# Altium schematic sheet main_2.SchDoc: main
size 282 x 200 mm; Date: 9/25/2019 7:26:07 PM; SheetNumber: 3; CNAME: RJ Cunningham; GateName_1: G$1; SymbolName_1: A4L-LOC; LibraryName: frames; DeviceSetName: A4L-LOC
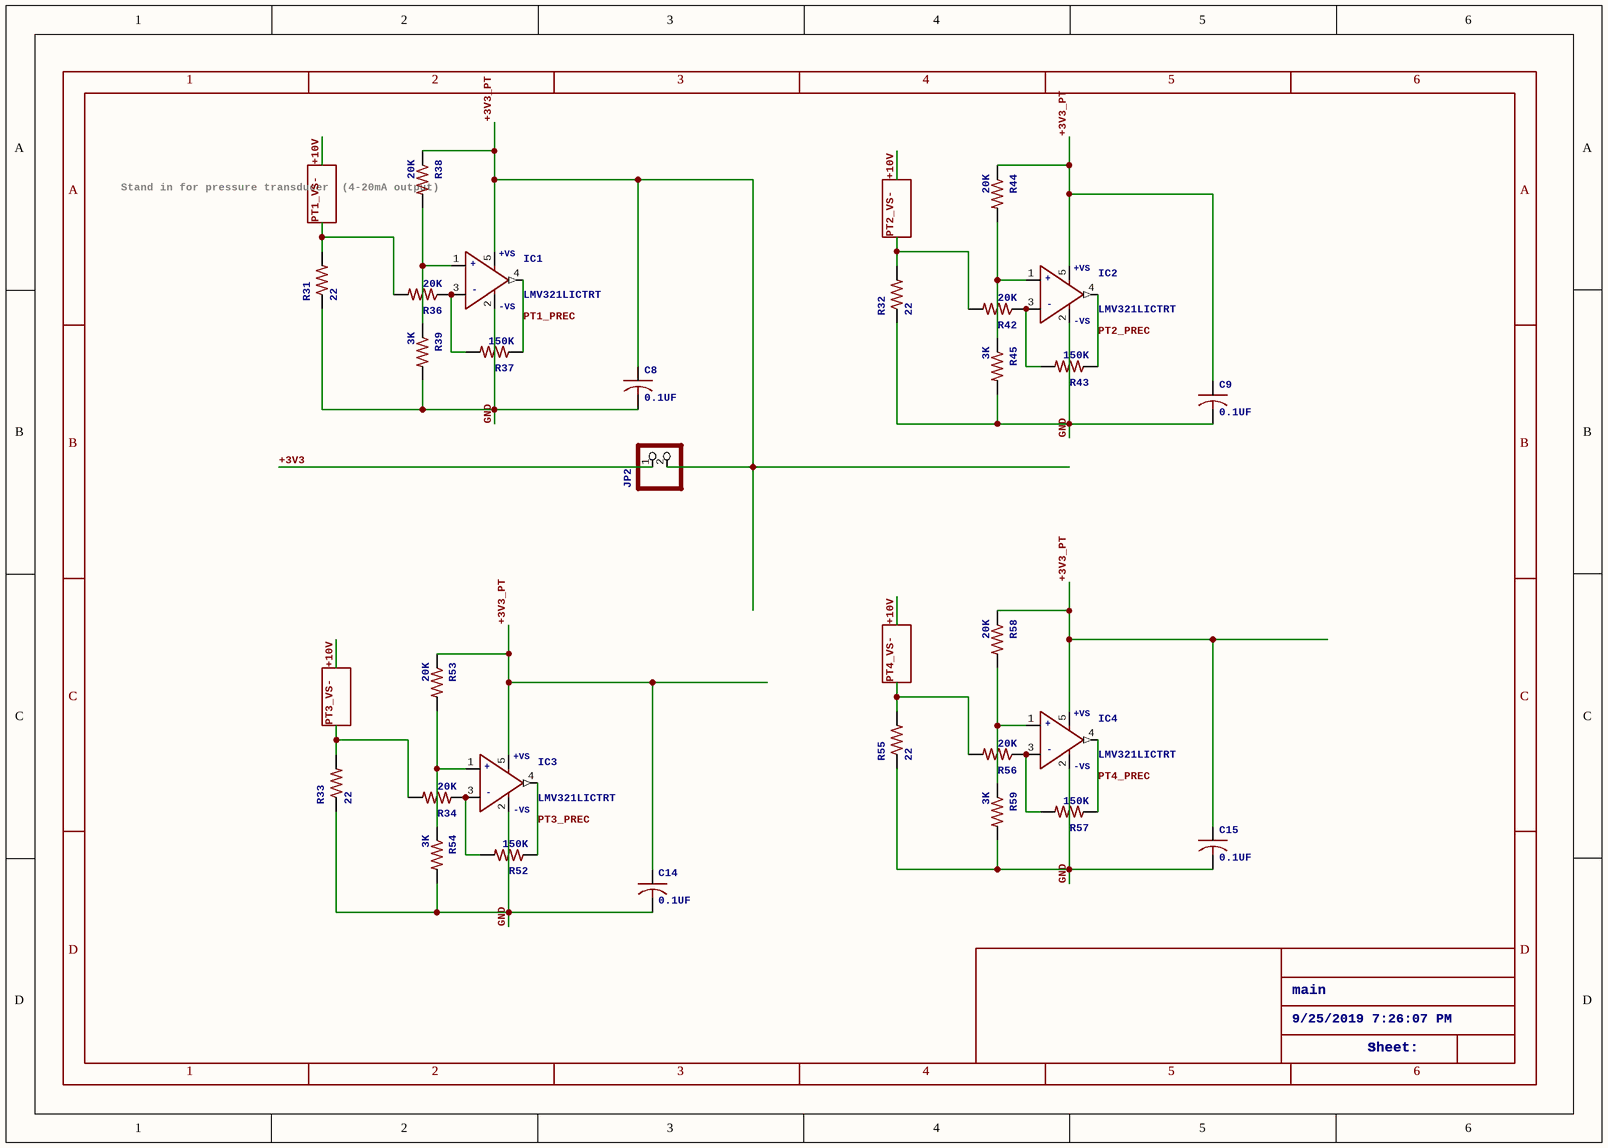
[diagram p0: main_2.SchDoc]

## Parts
C8  0.1UF  [C0805]
C9  0.1UF  [C0805]
C14  0.1UF  [C0805]
C15  0.1UF  [C0805]
IC1  LMV321LICTRT  [SOT23-5]
IC2  LMV321LICTRT  [SOT23-5]
IC3  LMV321LICTRT  [SOT23-5]
IC4  LMV321LICTRT  [SOT23-5]
JP2  PINHD-1X2  [1X02]  (value not drawn)
R31  22  [R0805]
R32  22  [R0805]
R33  22  [R0805]
R34  20K  [R0805]
R36  20K  [R0805]
R37  150K  [R0805]
R38  20K  [R0805]
R39  3K  [R0805]
R42  20K  [R0805]
R43  150K  [R0805]
R44  20K  [R0805]
R45  3K  [R0805]
R52  150K  [R0805]
R53  20K  [R0805]
R54  3K  [R0805]
R55  22  [R0805]
R56  20K  [R0805]
R57  150K  [R0805]
R58  20K  [R0805]
R59  3K  [R0805]

## Nets
+3V3: JP2.1
+3V3_PT: C8.1 C9.1 C14.1 C15.1 IC1.5(+VS) IC2.5(+VS) IC3.5(+VS) IC4.5(+VS) JP2.2 R38.1 R44.1 R53.1 R58.1
GND: C8.2 C9.2 C14.2 C15.2 IC1.2(-VS) IC2.2(-VS) IC3.2(-VS) IC4.2(-VS) R31.1 R32.1 R33.1 R39.2 R45.2 R54.2 R55.1 R59.2
PT1_PREC: IC1.4(OUT) R37.1
PT1_VS-: R31.2 R36.2
PT2_PREC: IC2.4(OUT) R43.1
PT2_VS-: R32.2 R42.2
PT3_PREC: IC3.4(OUT) R52.1
PT3_VS-: R33.2 R34.2
PT4_PREC: IC4.4(OUT) R57.1
PT4_VS-: R55.2 R56.2
NetIC1_1: IC1.1(IN+) R38.2 R39.1
NetIC1_3: IC1.3(IN-) R36.1 R37.2
NetIC2_1: IC2.1(IN+) R44.2 R45.1
NetIC2_3: IC2.3(IN-) R42.1 R43.2
NetIC3_1: IC3.1(IN+) R53.2 R54.1
NetIC3_3: IC3.3(IN-) R34.1 R52.2
NetIC4_1: IC4.1(IN+) R58.2 R59.1
NetIC4_3: IC4.3(IN-) R56.1 R57.2

## Notes on the sheet
- (near R38) Stand in for pressure transducer
  (4-20mA output)
- main
- 9/25/2019 7:26:07 PM
- 3
- Sheet:
- 1
- 2
- 4
- 5
- 6
- A
- B
- C
- D

## Library data of the parts
C8 C9 C14 C15 = C-USC0805: CAPACITOR, American symbol; GateName_1: G$1; SymbolName_1: C-US; DeviceName: C0805; LibraryName: rcl; DeviceSetName: C-US; SPICEPREFIX: C
IC1-IC4 = LMV321LICTRT: High Performance, 145 MHz FastFET Op AmpsSource: http://www.analog.com/static/imported-files/data_sheets/AD8065_8066.pdf; MPN: AD8065ARTZ-REEL7; GateName_1: G$; SymbolName_1: OP+-VS; DeviceName: RT; MF: ALTERA CORPORATION; LibraryName: st-microelectronics-extra; DeviceSetName: LMV321LICT; OC_FARNELL: 1464845; OC_NEWARK: 59K6316; +: +; -: -; +VS: +VS; -VS: -VS
JP2 = PINHD-1X2: PIN HEADER; GateName_1: G$1; SymbolName_1: PINHD2; LibraryName: pinhead; DeviceSetName: PINHD-1X2
R31-R34 R36-R39 R42-R45 R52-R59 = R-US_R0805: RESISTOR, American symbol; GateName_1: G$1; SymbolName_1: R-US; DeviceSetName: R-US_; DeviceName: R0805; LibraryName: rcl